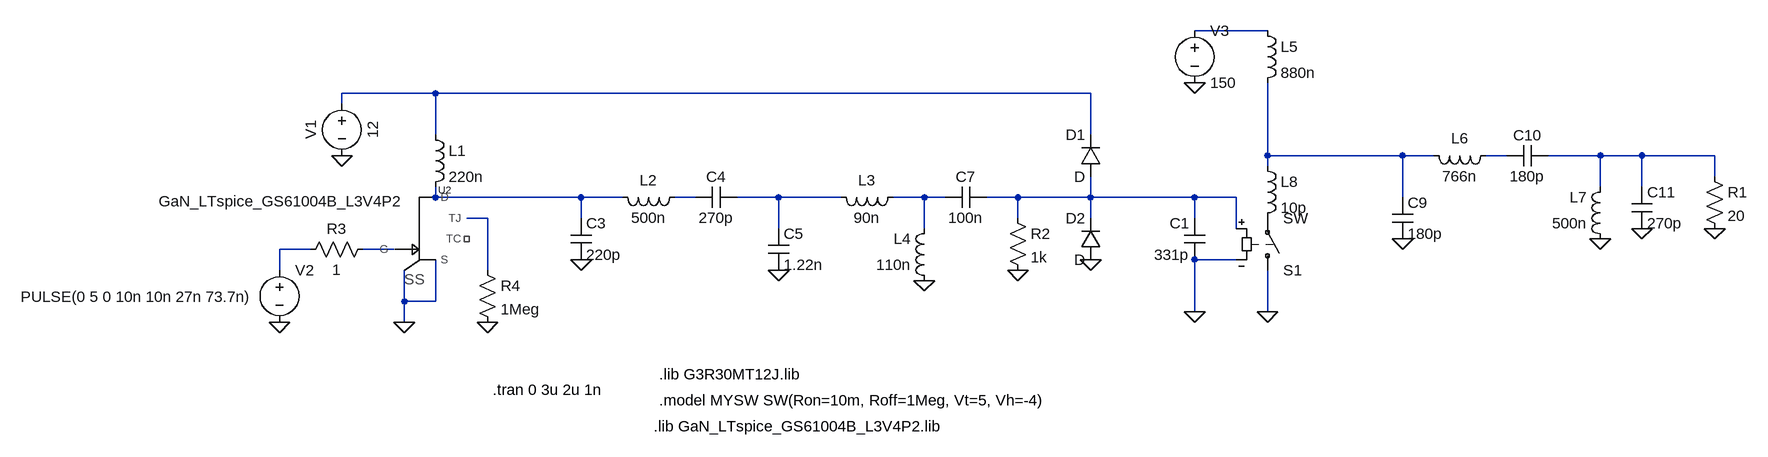
[diagram p0: schematic rf_gen.asc]
rf_gen.asc, the LTspice schematic file:
Version 4
SHEET 1 2116 680
WIRE 1360 -128 1248 -128
WIRE 80 -32 -64 -32
WIRE 1088 -32 80 -32
WIRE -64 -16 -64 -32
WIRE 80 32 80 -32
WIRE 1088 32 1088 -32
WIRE 1360 64 1360 -48
WIRE 1568 64 1360 64
WIRE 1616 64 1568 64
WIRE 1728 64 1696 64
WIRE 1872 64 1792 64
WIRE 1936 64 1872 64
WIRE 2048 64 1936 64
WIRE 1360 80 1360 64
WIRE 2048 96 2048 64
WIRE 1872 112 1872 64
WIRE 1936 112 1936 64
WIRE 80 128 80 112
WIRE 304 128 80 128
WIRE 368 128 304 128
WIRE 480 128 448 128
WIRE 608 128 544 128
WIRE 704 128 608 128
WIRE 832 128 784 128
WIRE 864 128 832 128
WIRE 976 128 928 128
WIRE 1088 128 1088 96
WIRE 1088 128 976 128
WIRE 1248 128 1088 128
WIRE 1312 128 1248 128
WIRE 1568 128 1568 64
WIRE 160 160 128 160
WIRE 304 160 304 128
WIRE 976 160 976 128
WIRE 1088 160 1088 128
WIRE 1248 160 1248 128
WIRE 608 176 608 128
WIRE 832 176 832 128
WIRE 1312 176 1312 128
WIRE -112 208 -160 208
WIRE 16 208 -32 208
WIRE 1312 224 1248 224
WIRE -160 240 -160 208
WIRE 160 240 160 160
WIRE 32 288 32 240
WIRE 80 288 80 224
WIRE 80 288 32 288
WIRE 1248 304 1248 224
WIRE 1360 304 1360 240
WIRE 32 320 32 288
FLAG 832 256 0
FLAG 608 240 0
FLAG 304 224 0
FLAG -160 320 0
FLAG 1088 224 0
FLAG -64 64 0
FLAG 1248 -48 0
FLAG 2048 176 0
FLAG 1936 176 0
FLAG 1872 192 0
FLAG 1568 192 0
FLAG 976 240 0
FLAG 1248 304 0
FLAG 1360 304 0
FLAG 32 320 0
FLAG 160 320 0
SYMBOL ind 64 16 R0
SYMATTR InstName L1
SYMATTR Value 220n
SYMATTR SpiceLine Rser=11m
SYMBOL ind 464 112 R90
WINDOW 0 5 56 VBottom 2
WINDOW 3 32 56 VTop 2
SYMATTR InstName L2
SYMATTR Value 500n
SYMATTR SpiceLine Rser=45m
SYMBOL ind 800 112 R90
WINDOW 0 5 56 VBottom 2
WINDOW 3 32 56 VTop 2
SYMATTR InstName L3
SYMATTR Value 90n
SYMATTR SpiceLine Rser=5.5m
SYMBOL ind 848 272 R180
WINDOW 0 36 80 Left 2
WINDOW 3 36 40 Left 2
SYMATTR InstName L4
SYMATTR Value 110n
SYMATTR SpiceLine Rser=6.5m
SYMBOL cap 592 176 R0
SYMATTR InstName C5
SYMATTR Value 1.22n
SYMBOL cap 288 160 R0
SYMATTR InstName C3
SYMATTR Value 220p
SYMBOL cap 928 112 R90
WINDOW 0 0 32 VBottom 2
WINDOW 3 32 32 VTop 2
SYMATTR InstName C7
SYMATTR Value 100n
SYMBOL voltage -64 -32 R0
WINDOW 0 -32 56 VBottom 2
WINDOW 3 32 56 VTop 2
WINDOW 123 0 0 Left 0
WINDOW 39 0 0 Left 0
SYMATTR InstName V1
SYMATTR Value 12
SYMBOL voltage -160 224 R0
WINDOW 3 -398 57 Left 2
WINDOW 123 0 0 Left 0
WINDOW 39 0 0 Left 0
SYMATTR Value PULSE(0 5 0 10n 10n 27n 73.7n)
SYMATTR InstName V2
SYMBOL cap 544 112 R90
WINDOW 0 0 32 VBottom 2
WINDOW 3 32 32 VTop 2
SYMATTR InstName C4
SYMATTR Value 270p
SYMBOL diode 1104 96 R180
WINDOW 0 24 64 Left 2
WINDOW 3 24 0 Left 2
SYMATTR InstName D1
SYMBOL diode 1104 224 R180
WINDOW 0 24 64 Left 2
WINDOW 3 24 0 Left 2
SYMATTR InstName D2
SYMBOL ind 1344 -144 R0
SYMATTR InstName L5
SYMATTR Value 880n
SYMATTR SpiceLine Rser=50m
SYMBOL voltage 1248 -144 R0
WINDOW 123 0 0 Left 0
WINDOW 39 0 0 Left 0
SYMATTR InstName V3
SYMATTR Value 150
SYMBOL cap 1552 128 R0
SYMATTR InstName C9
SYMATTR Value 180p
SYMBOL ind 1712 48 R90
WINDOW 0 5 56 VBottom 2
WINDOW 3 32 56 VTop 2
SYMATTR InstName L6
SYMATTR Value 766n
SYMATTR SpiceLine Rser=100m
SYMBOL ind 1888 208 R180
WINDOW 0 36 80 Left 2
WINDOW 3 36 40 Left 2
SYMATTR InstName L7
SYMATTR Value 500n
SYMATTR SpiceLine Rser=40m
SYMBOL cap 1920 112 R0
SYMATTR InstName C11
SYMATTR Value 270p
SYMBOL cap 1792 48 R90
WINDOW 0 0 32 VBottom 2
WINDOW 3 32 32 VTop 2
SYMATTR InstName C10
SYMATTR Value 180p
SYMBOL res 2032 80 R0
SYMATTR InstName R1
SYMATTR Value 20
SYMBOL res 960 144 R0
SYMATTR InstName R2
SYMATTR Value 1k
SYMBOL res -16 192 R90
WINDOW 0 0 56 VBottom 2
WINDOW 3 32 56 VTop 2
SYMATTR InstName R3
SYMATTR Value 1
SYMBOL GaN_LTspice_GS61004B_L3V4P2 32 176 R0
WINDOW 3 -189 -42 Center 2
SYMATTR InstName U2
SYMBOL res 144 224 R0
SYMATTR InstName R4
SYMATTR Value 1Meg
SYMBOL sw 1360 256 M180
SYMATTR InstName S1
SYMATTR SpiceModel MYSW
SYMBOL ind 1344 64 R0
SYMATTR InstName L8
SYMATTR Value 10p
SYMATTR SpiceLine Rser=.1
SYMBOL cap 1264 160 M0
SYMATTR InstName C1
SYMATTR Value 331p
TEXT 168 424 Left 2 !.tran 0 3u 2u 1n
TEXT 416 480 Left 2 !.lib GaN_LTspice_GS61004B_L3V4P2.lib
TEXT 424 400 Left 2 !.lib G3R30MT12J.lib
TEXT 424 440 Left 2 !.model MYSW SW(Ron=10m, Roff=1Meg, Vt=5, Vh=-4)

The netlist it stands for:
* rf_gen.asc
L1 N002 N006 220n Rser=11m
L2 N007 N006 500n Rser=45m
L3 N009 N008 90n Rser=5.5m
L4 0 N009 110n Rser=6.5m
C5 N008 0 1.22n
C3 N006 0 220p
C7 N010 N009 100n
V1 N002 0 12
V2 N012 0 PULSE(0 5 0 10n 10n 27n 73.7n)
C4 N008 N007 270p
D1 N010 N002 D
D2 0 N010 D
L5 N001 N003 880n Rser=50m
V3 N001 0 150
C9 N003 0 180p
L6 N004 N003 766n Rser=100m
L7 0 N005 500n Rser=40m
C11 N005 0 270p
C10 N005 N004 180p
R1 N005 0 20
R2 N010 0 1k
R3 N013 N012 1
XU2 N013 N006 0 0 NC_01 N011 GaN_LTspice_GS61004B_L3V4P2  ; pins G D S SS TC TJ
R4 N011 0 1Meg
S1 0 P001 N010 0 MYSW SW
L8 N003 P001 10p Rser=.1
C1 N010 0 331p
.model D D
.lib standard.dio
.tran 0 3u 2u 1n
.lib GaN_LTspice_GS61004B_L3V4P2.lib
.lib G3R30MT12J.lib
.model MYSW SW(Ron=10m, Roff=1Meg, Vt=5, Vh=-4)
.lib GaN_LTspice_GS61004B_L3V4P2.lib
.backanno
.end